# EAGLE design bc-led_pwm-universal (EAGLE 9.5.2)
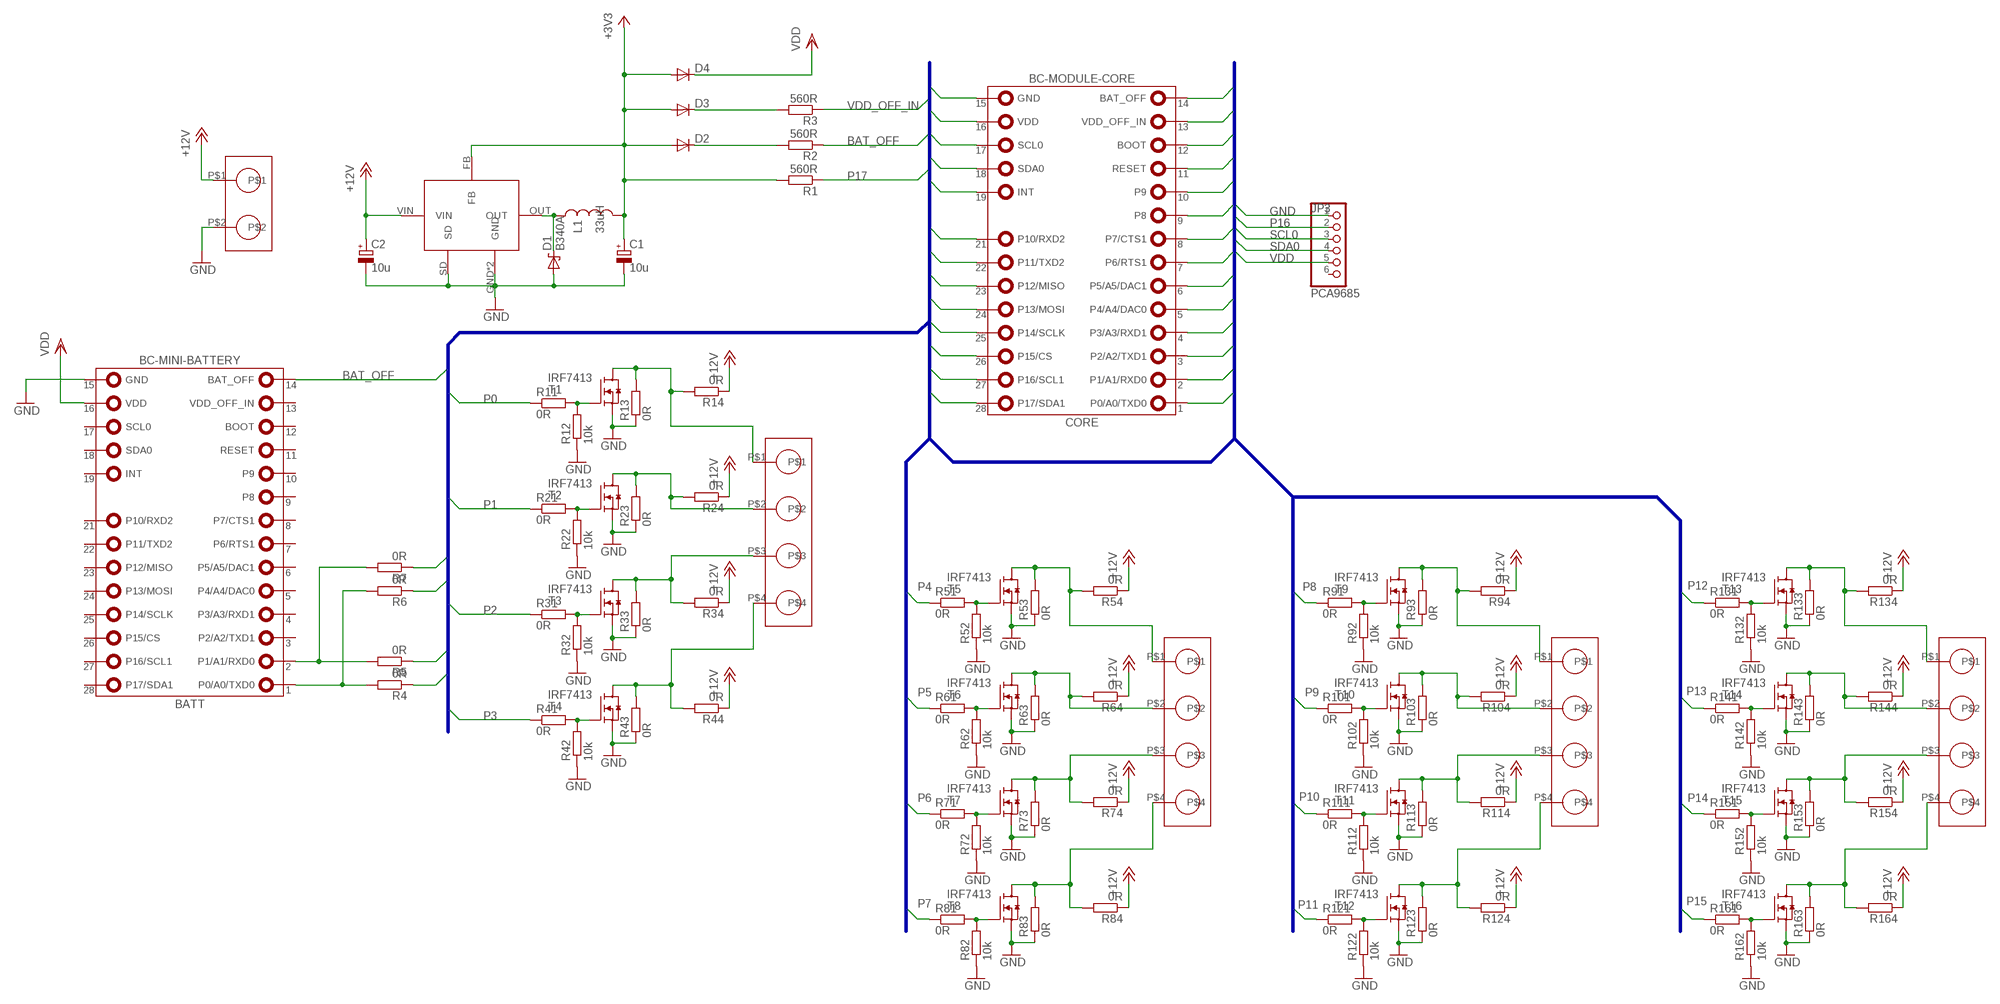
[diagram p0: schematic, sheet 1]

## Parts
BATT  BC-MINI-BATTERY  BC-MODULE-CORE  [BC-MODULE-CORE]
C1  10u  CPOL-EUE1.8-4  [E1,8-4]
C2  10u  CPOL-EUE2-5  [E2-5]
CORE  BC-MODULE-CORE  [BC-MODULE-CORE]
D1  B340A  SCHOTTKY-DIODESMD  [SMB]
D2  PMLL41SOD80C  [SOD80C]
D3  PMLL41SOD80C  [SOD80C]
D4  PMLL41SOD80C  [SOD80C]
JP1  STLZ950/2G-5.08-H  [HDR-5.08-1_2]
JP2A  STLZ950/4G-5.08-V  [HDR-5.08-1_4]
JP2B  STLZ950/4G-5.08-V  [HDR-5.08-1_4]
JP2C  STLZ950/4G-5.08-V  [HDR-5.08-1_4]
JP2D  STLZ950/4G-5.08-V  [HDR-5.08-1_4]
JP3  PCA9685  PINHD-1X6  [1X06]
L1  33uH  L-GENERIC-BC12  [BC12]
R1  560R  R-EU_R3216  [R3216]
R2  560R  R-EU_R3216  [R3216]
R3  560R  R-EU_R3216  [R3216]
R4  0R  R-EU_R3216  [R3216]
R5  0R  R-EU_R3216  [R3216]
R6  0R  R-EU_R3216  [R3216]
R7  0R  R-EU_R3216  [R3216]
R11  0R  R-EU_0207/7  [0207/7]
R12  10k  R-EU_R3216  [R3216]
R13  0R  R-EU_R3216  [R3216]
R14  0R  R-EU_R3216  [R3216]
R21  0R  R-EU_0207/7  [0207/7]
R22  10k  R-EU_R3216  [R3216]
R23  0R  R-EU_R3216  [R3216]
R24  0R  R-EU_R3216  [R3216]
R31  0R  R-EU_0207/7  [0207/7]
R32  10k  R-EU_R3216  [R3216]
R33  0R  R-EU_R3216  [R3216]
R34  0R  R-EU_R3216  [R3216]
R41  0R  R-EU_0207/7  [0207/7]
R42  10k  R-EU_R3216  [R3216]
R43  0R  R-EU_R3216  [R3216]
R44  0R  R-EU_R3216  [R3216]
R51  0R  R-EU_0207/7  [0207/7]
R52  10k  R-EU_R3216  [R3216]
R53  0R  R-EU_R3216  [R3216]
R54  0R  R-EU_R3216  [R3216]
R61  0R  R-EU_0207/7  [0207/7]
R62  10k  R-EU_R3216  [R3216]
R63  0R  R-EU_R3216  [R3216]
R64  0R  R-EU_R3216  [R3216]
R71  0R  R-EU_0207/7  [0207/7]
R72  10k  R-EU_R3216  [R3216]
R73  0R  R-EU_R3216  [R3216]
R74  0R  R-EU_R3216  [R3216]
R81  0R  R-EU_0207/7  [0207/7]
R82  10k  R-EU_R3216  [R3216]
R83  0R  R-EU_R3216  [R3216]
R84  0R  R-EU_R3216  [R3216]
R91  0R  R-EU_0207/7  [0207/7]
R92  10k  R-EU_R3216  [R3216]
R93  0R  R-EU_R3216  [R3216]
R94  0R  R-EU_R3216  [R3216]
R101  0R  R-EU_0207/7  [0207/7]
R102  10k  R-EU_R3216  [R3216]
R103  0R  R-EU_R3216  [R3216]
R104  0R  R-EU_R3216  [R3216]
R111  0R  R-EU_0207/7  [0207/7]
R112  10k  R-EU_R3216  [R3216]
R113  0R  R-EU_R3216  [R3216]
R114  0R  R-EU_R3216  [R3216]
R121  0R  R-EU_0207/7  [0207/7]
R122  10k  R-EU_R3216  [R3216]
R123  0R  R-EU_R3216  [R3216]
R124  0R  R-EU_R3216  [R3216]
R131  0R  R-EU_0207/7  [0207/7]
R132  10k  R-EU_R3216  [R3216]
R133  0R  R-EU_R3216  [R3216]
R134  0R  R-EU_R3216  [R3216]
R141  0R  R-EU_0207/7  [0207/7]
R142  10k  R-EU_R3216  [R3216]
R143  0R  R-EU_R3216  [R3216]
R144  0R  R-EU_R3216  [R3216]
R151  0R  R-EU_0207/7  [0207/7]
R152  10k  R-EU_R3216  [R3216]
R153  0R  R-EU_R3216  [R3216]
R154  0R  R-EU_R3216  [R3216]
R161  0R  R-EU_0207/7  [0207/7]
R162  10k  R-EU_R3216  [R3216]
R163  0R  R-EU_R3216  [R3216]
R164  0R  R-EU_R3216  [R3216]
T1  IRF7413  [SO8]
T2  IRF7413  [SO8]
T3  IRF7413  [SO8]
T4  IRF7413  [SO8]
T5  IRF7413  [SO8]
T6  IRF7413  [SO8]
T7  IRF7413  [SO8]
T8  IRF7413  [SO8]
T9  IRF7413  [SO8]
T10  IRF7413  [SO8]
T11  IRF7413  [SO8]
T12  IRF7413  [SO8]
T13  IRF7413  [SO8]
T14  IRF7413  [SO8]
T15  IRF7413  [SO8]
T16  IRF7413  [SO8]
U$1  AP1501  [TO263-5L]

## Nets
+3V3: C1.+ D2.A D3.A D4.A L1.2 R1.2 U$1.FB
+12V: C2.+ JP1.P$1 R14.1 R24.1 R34.1 R44.1 R54.1 R64.1 R74.1 R84.1 R94.1 R104.1 R114.1 R124.1 R134.1 R144.1 R154.1 R164.1 U$1.VIN
BAT_OFF: BATT.14(BAT_OFF) CORE.14(BAT_OFF) R2.1
BOOT: CORE.12(BOOT)
GND: BATT.15(GND) C1.- C2.- CORE.15(GND) D1.A JP1.P$2 JP3.1 R12.1 R13.1 R22.1 R23.1 R32.1 R33.1 R42.1 R43.1 R52.1 R53.1 R62.1 R63.1 R72.1 R73.1 R82.1 R83.1 R92.1 R93.1 R102.1 R103.1 R112.1 R113.1 R122.1 R123.1 R132.1 R133.1 R142.1 R143.1 R152.1 R153.1 R162.1 R163.1 T1.1(S) T1.2(S) T1.3(S) T2.1(S) T2.2(S) T2.3(S) T3.1(S) T3.2(S) T3.3(S) T4.1(S) T4.2(S) T4.3(S) T5.1(S) T5.2(S) T5.3(S) T6.1(S) T6.2(S) T6.3(S) T7.1(S) T7.2(S) T7.3(S) T8.1(S) T8.2(S) T8.3(S) T9.1(S) T9.2(S) T9.3(S) T10.1(S) T10.2(S) T10.3(S) T11.1(S) T11.2(S) T11.3(S) T12.1(S) T12.2(S) T12.3(S) T13.1(S) T13.2(S) T13.3(S) T14.1(S) T14.2(S) T14.3(S) T15.1(S) T15.2(S) T15.3(S) T16.1(S) T16.2(S) T16.3(S) U$1.GND U$1.GND2(GND) U$1.SD
INT: CORE.19(INT)
N$2: R11.2 R12.2 T1.4(G)
N$4: JP2A.P$1 R13.2 R14.2 T1.5(D) T1.6(D) T1.7(D) T1.8(D)
N$5: BATT.2(P1/A1/RXD0) R5.2 R7.2
N$6: BATT.1(P0/A0/TXD0) R4.2 R6.2
N$7: D1.C L1.1 U$1.OUT
N$8: R31.2 R32.2 T3.4(G)
N$9: JP2A.P$3 R33.2 R34.2 T3.5(D) T3.6(D) T3.7(D) T3.8(D)
N$10: R21.2 R22.2 T2.4(G)
N$11: JP2A.P$2 R23.2 R24.2 T2.5(D) T2.6(D) T2.7(D) T2.8(D)
N$12: R41.2 R42.2 T4.4(G)
N$13: JP2A.P$4 R43.2 R44.2 T4.5(D) T4.6(D) T4.7(D) T4.8(D)
N$14: D2.C R2.2
N$15: D3.C R3.2
N$22: R51.2 R52.2 T5.4(G)
N$23: JP2B.P$1 R53.2 R54.2 T5.5(D) T5.6(D) T5.7(D) T5.8(D)
N$24: R61.2 R62.2 T6.4(G)
N$25: JP2B.P$2 R63.2 R64.2 T6.5(D) T6.6(D) T6.7(D) T6.8(D)
N$26: R71.2 R72.2 T7.4(G)
N$27: JP2B.P$3 R73.2 R74.2 T7.5(D) T7.6(D) T7.7(D) T7.8(D)
N$28: R81.2 R82.2 T8.4(G)
N$29: JP2B.P$4 R83.2 R84.2 T8.5(D) T8.6(D) T8.7(D) T8.8(D)
N$38: R91.2 R92.2 T9.4(G)
N$39: JP2C.P$1 R93.2 R94.2 T9.5(D) T9.6(D) T9.7(D) T9.8(D)
N$40: R101.2 R102.2 T10.4(G)
N$41: JP2C.P$2 R103.2 R104.2 T10.5(D) T10.6(D) T10.7(D) T10.8(D)
N$42: R111.2 R112.2 T11.4(G)
N$43: JP2C.P$3 R113.2 R114.2 T11.5(D) T11.6(D) T11.7(D) T11.8(D)
N$44: R121.2 R122.2 T12.4(G)
N$45: JP2C.P$4 R123.2 R124.2 T12.5(D) T12.6(D) T12.7(D) T12.8(D)
N$54: R131.2 R132.2 T13.4(G)
N$55: JP2D.P$1 R133.2 R134.2 T13.5(D) T13.6(D) T13.7(D) T13.8(D)
N$56: R141.2 R142.2 T14.4(G)
N$57: JP2D.P$2 R143.2 R144.2 T14.5(D) T14.6(D) T14.7(D) T14.8(D)
N$58: R151.2 R152.2 T15.4(G)
N$59: JP2D.P$3 R153.2 R154.2 T15.5(D) T15.6(D) T15.7(D) T15.8(D)
N$60: R161.2 R162.2 T16.4(G)
N$61: JP2D.P$4 R163.2 R164.2 T16.5(D) T16.6(D) T16.7(D) T16.8(D)
P0: CORE.1(P0/A0/TXD0) R4.1 R11.1
P1: CORE.2(P1/A1/RXD0) R5.1 R21.1
P2: CORE.3(P2/A2/TXD1) R31.1
P3: CORE.4(P3/A3/RXD1) R41.1
P4: CORE.5(P4/A4/DAC0) R6.1 R51.1
P5: CORE.6(P5/A5/DAC1) R7.1 R61.1
P6: CORE.7(P6/RTS1) R71.1
P7: CORE.8(P7/CTS1) R81.1
P8: CORE.9(P8) R91.1
P9: CORE.10(P9) R101.1
P10: CORE.21(P10/RXD2) R111.1
P11: CORE.22(P11/TXD2) R121.1
P12: CORE.23(P12/MISO) R131.1
P13: CORE.24(P13/MOSI) R141.1
P14: CORE.25(P14/SCLK) R151.1
P15: CORE.26(P15/CS) R161.1
P16: CORE.27(P16/SCL1) JP3.2
P17: CORE.28(P17/SDA1) R1.1
RESET: CORE.11(RESET)
SCL0: CORE.17(SCL0) JP3.3
SDA0: CORE.18(SDA0) JP3.4
VDD: BATT.16(VDD) CORE.16(VDD) D4.C JP3.5
VDD_OFF_IN: CORE.13(VDD_OFF_IN) R3.1
Unconnected: BATT.3(P2/A2/TXD1) BATT.4(P3/A3/RXD1) BATT.5(P4/A4/DAC0) BATT.6(P5/A5/DAC1) BATT.7(P6/RTS1) BATT.8(P7/CTS1) BATT.9(P8) BATT.10(P9) BATT.11(RESET) BATT.12(BOOT) BATT.13(VDD_OFF_IN) BATT.17(SCL0) BATT.18(SDA0) BATT.19(INT) BATT.21(P10/RXD2) BATT.22(P11/TXD2) BATT.23(P12/MISO) BATT.24(P13/MOSI) BATT.25(P14/SCLK) BATT.26(P15/CS) BATT.27(P16/SCL1) BATT.28(P17/SDA1) JP3.6

## Buses
HARDWARIO:BAT_OFF,BOOT,GND,INT,P[0..17],RESET,SCL0,SDA0,VDD,VDD_OFF_IN

## Library data of the parts
BATT CORE = bigclown:BC-MODULE-CORE: BigClown Core Module Follow this link <https://shop.bigclown.com/products/core-module> for more information.
C1 C2 = resistor:CPOL-EU: POLARIZED CAPACITOR, European symbol
D1 = diode:SCHOTTKY-DIODE: Schottky Diode
D2-D4 = diode:PMLL41*: High-speed diodes Source: http://www.semiconductors.philips.com/acrobat_download/datasheets/PMLL4150_2.pdf
JP1 = mixi:STLZ950/2G-5.08-H
JP2A JP2B JP2C JP2D = mixi:STLZ950/4G-5.08-V
JP3 = pinhead:PINHD-1X6: PIN HEADER
L1 = mixi-inductors:L-GENERIC-BC12
R1-R7 R11-R14 R21-R24 R31-R34 R41-R44 R51-R54 R61-R64 R71-R74 R81-R84 R91-R94 R101-R104 R111-R114 R121-R124 R131-R134 R141-R144 R151-R154 R161-R164 = resistor:R-EU_: RESISTOR, European symbol
T1-T16 = mixi:IRF7413: IRF7413, N-channel HEXFET Vds = 30V, Id = 9.2A (58A pulsed)
U$1 = mixi:AP1501: AP1501 3A 150kHz PWM DC/DC converter

## Net classes
0 default: clearance 0.205 mm

## Board
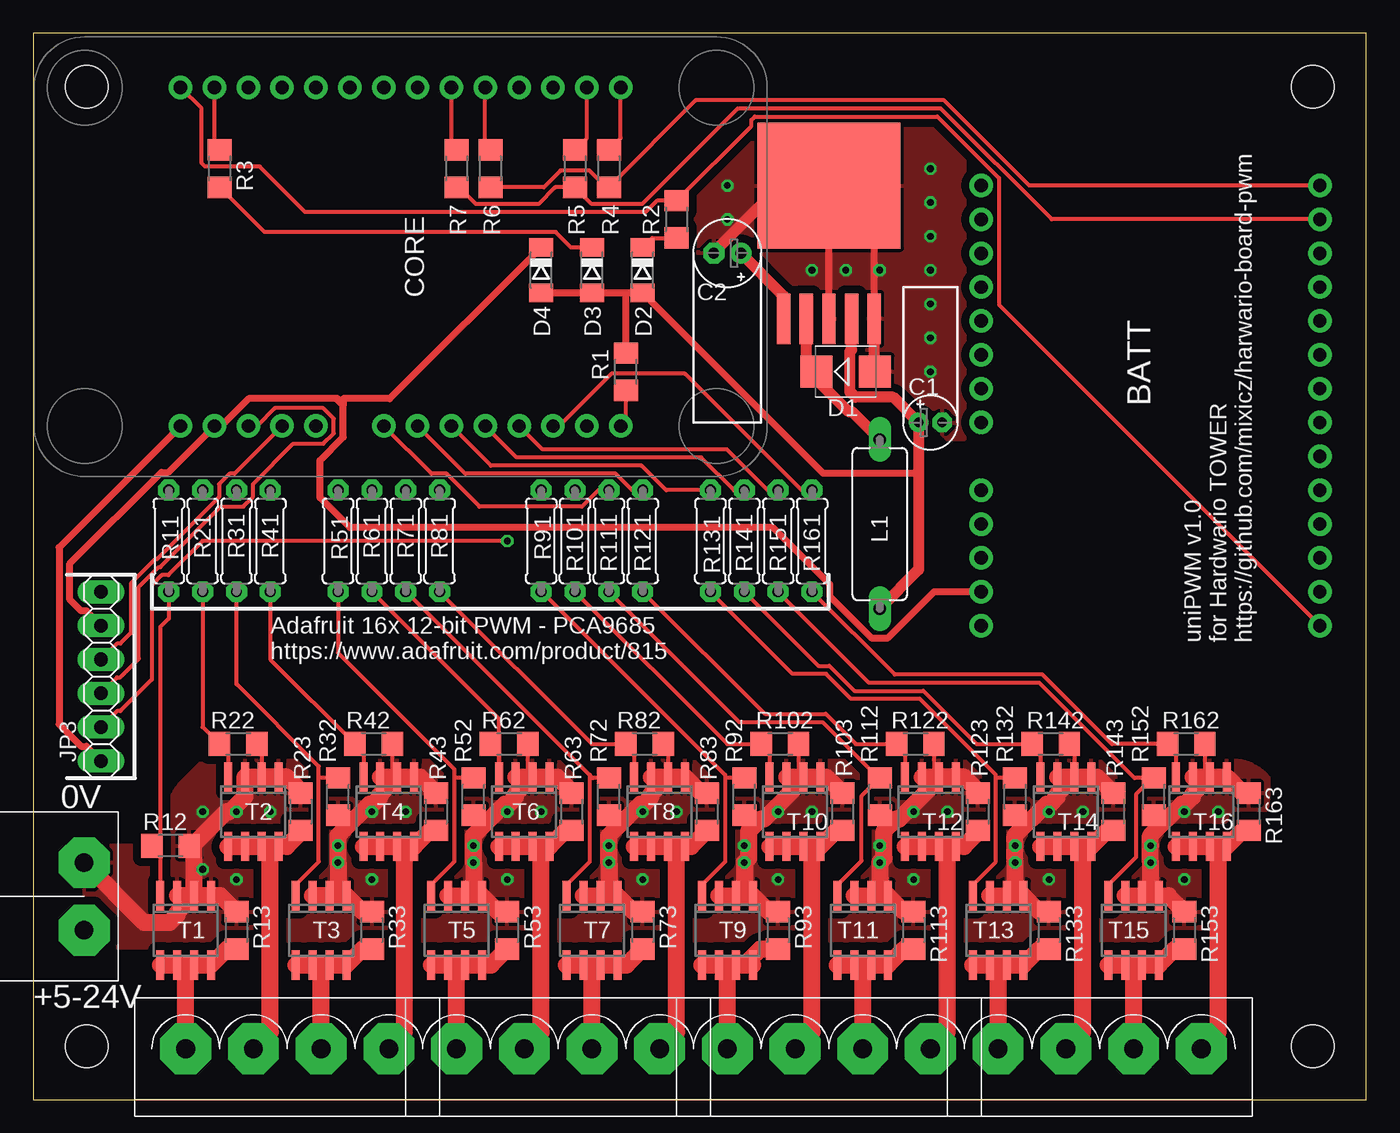
[diagram p1: board, top side]
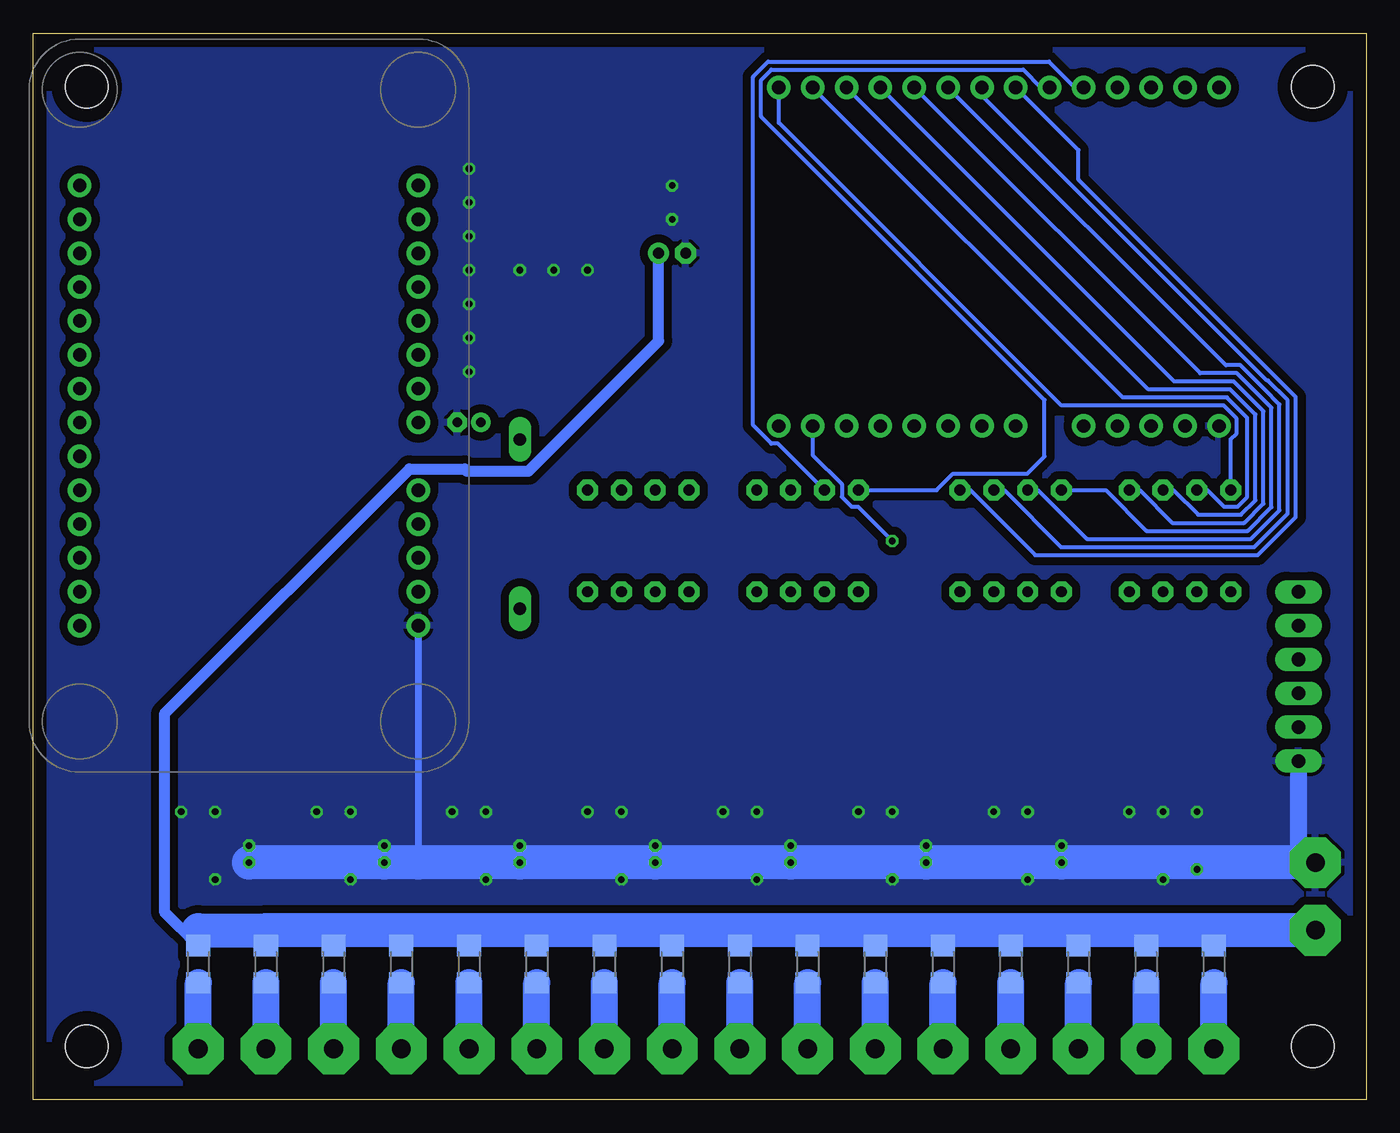
[diagram p2: board, bottom side, seen from below]

Size 100 x 80 mm. Coordinates in mm from the lower left corner, seen from the top.
Outline: 0,0 100,0 100,80 0,80 0,0
Copper layers (1*16): Top 0.035mm / dielectric 1.5mm / Bottom 0.035mm
Design rules "default *": minimum track width 0.3mm, minimum drill 0.35mm, track to track 0.3mm, track to pad 0.3mm, pad to pad 0.3mm, via to via 0.3mm, smd to smd 0.3mm, copper to edge 40mil, drill to drill 6mil, minimum pad ring 15mil, minimum via ring 8mil, stop-mask expansion 4mil, vias tented up to drill 0mil, thermal gap 10mil
Holes 3.2 mm at 4,4 96,4 96,76 4,76

### Footprints (pad centres in the part's own frame; a part is rotated, then mirrored left to right if it is on the bottom)
BC-MODULE-CORE = drill 1 pad 1.6: 1 -12.7,16.51; 2 -12.7,13.97; 3 -12.7,11.43; 4 -12.7,8.89; 5 -12.7,6.35; 6 -12.7,3.81; 7 -12.7,1.27; 8 -12.7,-1.27; 9 -12.7,-3.81; 10 -12.7,-6.35; 11 -12.7,-8.89; 12 -12.7,-11.43; 13 -12.7,-13.97; 14 -12.7,-16.51; 15 12.7,-16.51; 16 12.7,-13.97; 17 12.7,-11.43; 18 12.7,-8.89; 19 12.7,-6.35; 21 12.7,-1.27; 22 12.7,1.27; 23 12.7,3.81; 24 12.7,6.35; 25 12.7,8.89; 26 12.7,11.43; 27 12.7,13.97; 28 12.7,16.51
E1,8-4 = drill 0.711 pad 1.168: + -0.889,0 | drill 0.711 pad 1.168 octagon: - 0.889,0
E2-5 = drill 0.813 pad 1.27: + -1.016,0 | drill 0.813 pad 1.27 octagon: - 1.016,0
SMB = smd 2.4 x 2.4: A 2.2,0; C -2.2,0
SOD80C = smd 1.4 x 1.8: A 1.7,0; C -1.7,0
HDR-5.08-1_2 = drill 1.397 pad 3.81 octagon: P$1 0,2.54; P$2 0,-2.54
HDR-5.08-1_4 = drill 1.397 pad 3.81 octagon: P$1 0,7.62; P$2 0,2.54; P$3 0,-2.54; P$4 0,-7.62
1X06 = drill 1.016 long: 1 -6.35,0; 2 -3.81,0; 3 -1.27,0; 4 1.27,0; 5 3.81,0; 6 6.35,0
BC12 = drill 0.914 long: 1 -6.35,0; 2 6.35,0
R3216 = smd 1.6 x 1.8: 1 -1.4,0; 2 1.4,0
0207/7 = drill 0.813 octagon: 1 -3.81,0; 2 3.81,0
SO8 = smd 0.6 x 2.2: 1 -1.905,-2.6; 2 -0.635,-2.6; 3 0.635,-2.6; 4 1.905,-2.6; 5 1.905,2.6; 6 0.635,2.6; 7 -0.635,2.6; 8 -1.905,2.6
TO263-5L = smd 1 x 3.8: FB 1.7,-10; GND 0,-10; OUT -1.7,-10; SD 3.4,-10; VIN -3.4,-10 | smd 10.75 x 9.45: GND2 0,0

### Placement (x,y rotation side)
BATT  83.82,52.07 0 bottom
C1  67.31,50.8 0 top
C2  52.07,63.5 180 top
CORE  27.56,63.24 270 top
D1  60.96,54.61 0 top
D2  45.72,62.23 270 top
D3  41.91,62.23 270 top
D4  38.1,62.23 270 top
JP1  3.81,15.24 180 top
JP2A  19.05,3.81 90 top
JP2B  39.37,3.81 90 top
JP2C  59.69,3.81 90 top
JP2D  80.01,3.81 90 top
JP3  5.08,31.75 90 top
L1  63.5,43.18 270 top
R1  44.45,54.61 90 top
R2  48.26,66.04 270 top
R3  13.97,69.85 270 top
R4  43.18,69.85 270 top
R5  40.64,69.85 270 top
R6  34.29,69.85 270 top
R7  31.75,69.85 270 top
R11  10.16,41.91 270 top
R12  10.29,19.05 180 top
R13  15.24,12.7 270 top
R14  11.43,10.16 270 bottom
R21  12.7,41.91 270 top
R22  15.37,26.67 180 top
R23  20.07,21.59 270 top
R24  16.51,10.16 270 bottom
R31  15.24,41.91 270 top
R32  22.86,22.73 90 top
R33  25.4,12.7 270 top
R34  21.59,10.16 270 bottom
R41  17.78,41.91 270 top
R42  25.53,26.67 180 top
R43  30.23,21.59 270 top
R44  26.67,10.16 270 bottom
R51  22.86,41.91 270 top
R52  33.02,22.73 90 top
R53  35.56,12.7 270 top
R54  31.75,10.16 270 bottom
R61  25.4,41.91 270 top
R62  35.69,26.67 180 top
R63  40.39,21.59 270 top
R64  36.83,10.16 270 bottom
R71  27.94,41.91 270 top
R72  43.18,22.73 90 top
R73  45.72,12.7 270 top
R74  41.91,10.16 270 bottom
R81  30.48,41.91 270 top
R82  45.85,26.67 180 top
R83  50.55,21.59 270 top
R84  46.99,10.16 270 bottom
R91  38.1,41.91 270 top
R92  53.34,22.73 90 top
R93  55.88,12.7 270 top
R94  52.07,10.16 270 bottom
R101  40.64,41.91 270 top
R102  56.01,26.67 180 top
R103  60.71,21.59 270 top
R104  57.15,10.16 270 bottom
R111  43.18,41.91 270 top
R112  63.5,22.73 90 top
R113  66.04,12.7 270 top
R114  62.23,10.16 270 bottom
R121  45.72,41.91 270 top
R122  66.17,26.67 180 top
R123  70.87,21.59 270 top
R124  67.31,10.16 270 bottom
R131  50.8,41.91 270 top
R132  73.66,22.73 90 top
R133  76.2,12.7 270 top
R134  72.39,10.16 270 bottom
R141  53.34,41.91 270 top
R142  76.33,26.67 180 top
R143  81.03,21.59 270 top
R144  77.47,10.16 270 bottom
R151  55.88,41.91 270 top
R152  84.07,22.73 90 top
R153  86.36,12.7 270 top
R154  82.55,10.16 270 bottom
R161  58.42,41.91 270 top
R162  86.49,26.67 180 top
R163  91.19,21.59 270 top
R164  87.63,10.16 270 bottom
T1  11.43,12.7 180 top
T2  16.51,21.59 180 top
T3  21.59,12.7 180 top
T4  26.67,21.59 180 top
T5  31.75,12.7 180 top
T6  36.83,21.59 180 top
T7  41.91,12.7 180 top
T8  46.99,21.59 180 top
T9  52.07,12.7 180 top
T10  57.15,21.59 180 top
T11  62.23,12.7 180 top
T12  67.31,21.59 180 top
T13  72.39,12.7 180 top
T14  77.47,21.59 180 top
T15  82.55,12.7 180 top
T16  87.63,21.59 180 top
U$1  59.69,68.58 0 top

### Tracks (layer width: path | path; a pad name or v marks a point on that pad's centre or on a via)
+3V3
  Top 0.508: D4.A D3.A 44.45,60.53 | 44.45,60.53 D2.A 59.26,46.99 66.42,46.99 | R1.2 44.45,60.53
  Top 0.813: L1.2 66.42,39.75 66.42,46.99 C1.+ 64.52,52.7 61.67,52.7 61.25,53.12 61.25,56.1 61.39,56.24 U$1.FB
+12V
  Top 0.813: U$1.VIN 56.29,60.3 C2.+
  Bottom 0.813: R164.1 90.17,14.1 90.17,28.91 71.78,47.31 67.63,47.31 67.47,47.15 62.86,47.15 53.09,56.92 C2.+
  Bottom 1.27: R14.1 11.43,12.7 | R24.1 16.51,12.7 | R34.1 21.59,12.7 | R44.1 26.67,12.7 | R54.1 31.75,12.7 | R64.1 36.83,12.7 | R74.1 41.91,12.7 | R84.1 46.99,12.7 | R94.1 52.07,12.7 | R104.1 57.15,12.7 | R114.1 62.23,12.7 | R124.1 67.31,12.7 | R134.1 72.39,12.7 | R144.1 77.47,12.7 | R154.1 82.55,12.7 | R164.1 87.63,12.7
  Bottom 2.54: JP1.P$1 11.43,12.7 16.51,12.7 21.59,12.7 26.67,12.7 31.75,12.7 36.83,12.7 41.91,12.7 46.99,12.7 52.07,12.7 57.15,12.7 62.23,12.7 67.31,12.7 72.39,12.7 77.47,12.7 82.55,12.7 87.63,12.7
BAT_OFF
  Top 0.305: BATT.14 72.45,59.63 72.45,69.13 67.83,73.76 54.13,73.76 53.86,73.49 53.86,73.04 R2.1 46.78,67.44 45.93,66.59 20.39,66.59 16.99,70 12.88,70 12.62,70.26 12.62,74.37 CORE.14
GND  (via drill 0.5)
  Top 0.305: R162.1 87.89,24.57 T16.2 | R142.1 78.11,26.3 T14.2 | R152.1 84.07,20.06 83.82,19.81 | R132.1 73.66,19.81 | R122.1 67.57,24.57 T12.2 | R112.1 63.84,21 63.84,20.14 | R92.1 53.67,21 53.67,20.14 | R102.1 57.41,24.57 T10.2 | R82.1 47.62,26.3 T8.2 | R62.1 37.09,24.57 T6.2 | R42.1 26.93,24.57 T4.2 | R22.1 17.14,26.3 T2.2 | R12.1 11.81,19.17 12.06,19.17 | R32.1 v22.86,19.05 | R52.1 v33.02,19.05 | R72.1 v43.18,19.05
  Top 0.508: U$1.GND U$1.GND2 63.09,65.18 U$1.SD | JP3.1 3.98,26.5 3.59,26.5 1.94,28.15 1.94,41.43 CORE.15
  Top 0.813: D1.A 63.09,55.1 U$1.SD | C2.- 51.59,64.04 51.59,64.12 56.05,68.58 U$1.GND2
  Top 1.27: R13.1 14.04,15.3 T1.1 T1.2 | T1.2 T1.3 | R33.1 24.7,14.1 T3.1 T3.2 | T3.2 T3.3 | T4.3 T4.2 | R43.1 29.03,24.19 T4.1 T4.2 | T5.3 T5.2 | R53.1 34.85,14.1 T5.1 T5.2 | T7.3 T7.2 | R73.1 45.02,14.1 T7.1 T7.2 | T9.3 T9.2 | T9.2 T9.1 55.17,14.1 R93.1 | T11.3 T11.2 | T11.2 T11.1 65.33,14.1 R113.1 | T13.3 T13.2 | R133.1 75.5,14.1 T13.1 T13.2 | T15.3 T15.2 | R153.1 85.16,15.3 T15.1 T15.2 | T16.3 T16.2 | R163.1 90.73,22.99 T16.1 T16.2 | T14.3 T14.2 | R143.1 79.83,24.19 T14.1 T14.2 | T10.3 T10.2 | T10.2 T10.1 59.51,24.19 R103.1 | T8.3 T8.2 | T8.2 T8.1 50.09,22.99 R83.1 | T6.3 T6.2 | R63.1 40.51,22.99 39.31,24.19 T6.1 T6.2 | T5.2 33.02,15.94 v33.02,17.78 v33.02,19.05 33.02,19.81 35.37,22.16 35.61,22.16 36.16,22.7 36.16,22.89 T6.2 | T7.2 43.18,15.94 v43.18,17.78 v43.18,19.05 43.18,19.81 45.53,22.16 45.77,22.16 46.32,22.7 46.32,22.89 T8.2 | T9.2 53.34,15.94 v53.34,17.78 53.67,18.11 53.67,20.14 54.56,21.02 54.8,21.02 57.78,24.01 T10.2 | T11.2 63.5,15.94 v63.5,17.78 63.84,18.11 63.84,20.14 64.72,21.02 64.96,21.02 67.94,24.01 T12.2 | T13.2 73.66,15.94 v73.66,17.78 v73.66,19.05 73.66,19.81 76.01,22.16 76.25,22.16 76.8,22.7 76.8,22.89 T14.2 | T15.2 83.82,15.94 v83.82,17.78 v83.82,19.05 83.82,19.81 86.17,22.16 86.41,22.16 86.96,22.7 86.96,22.89 T16.2 | T1.2 12.06,19.17 14.48,21.59 14.73,21.59 15.88,22.74 T2.3 T2.2 T2.1 19.02,24.19 20.07,23.14 R23.1 | R123.1 70.87,23.14 69.82,24.19 T12.1 T12.2 | T12.3 T12.2 | T3.2 22.86,15.94 v22.86,17.78 v22.86,19.05 22.86,19.81 25.21,22.16 25.45,22.16 26,22.7 26,22.89 T4.2 | T1.2 10.76,13.99 10.76,13.81 10.21,13.27 8.32,13.27 JP1.P$2
  Bottom 0.508: BATT.15 71.12,17.78
  Bottom 1.27: JP3.1 5.08,17.78
  Bottom 2.54: JP1.P$2 5.08,17.78 v22.86,17.78 v33.02,17.78 v43.18,17.78 v53.34,17.78 v63.5,17.78 71.12,17.78 v73.66,17.78 v83.82,17.78
  other vias: 66.04,16.51 55.88,16.51 53.34,19.05 45.72,16.51 35.56,16.51 25.4,16.51 86.36,16.51 76.2,16.51 63.5,19.05 25.4,21.59 27.94,21.59 35.56,21.59 38.1,21.59 45.72,21.59 48.26,21.59 55.88,21.59 58.42,21.59 66.04,21.59 68.58,21.59 76.2,21.59 78.74,21.59 86.36,21.59 88.9,21.59 58.42,62.23 60.96,62.23 63.5,62.23 67.31,54.61 67.31,57.15 67.31,59.69 67.31,62.23 67.31,64.77 67.31,67.31 67.31,69.85 52.07,66.04 52.07,68.58 15.24,16.51 17.78,21.59 15.24,21.59 12.7,21.59 12.7,17.27
  pour Bottom (isolate 0.61): 0,80.01 100.33,80.01 100.33,0 0,0
  pour Top (isolate 0.61): 12.7,25.4 11.1,23.8 arc45 10.16,21.53 10.16,19.05 3.81,19.05 3.81,11.43 88.9,11.43 88.9,16.45 arc-45 89.84,18.72 91.44,20.32 91.77,20.65 arc45 92.71,22.92 92.71,24.13 92.38,24.46 arc45 90.11,25.4
  pour Top (isolate 0.61): 49.53,63.5 49.53,73.66 68.58,73.66 68.91,73.33 arc-45 69.85,71.06 69.85,49.53 68.58,49.53 55.55,62.56 arc45 53.28,63.5
N$2
  Top 0.305: R11.2 10.16,36.09 9.53,35.46 9.53,19.05 | 9.53,19.05 T1.4 | R12.2 9.53,19.05
N$4
  Top 1.27: T1.5 T1.6 T1.7 | T1.7 T1.8 14.54,11.3 R13.2 | JP2A.P$1 11.43,9.46 T1.7
  Bottom 2.032: JP2A.P$1 R14.2
N$5
  Top 0.305: R7.2 31.95,68.45 33.2,67.2 37.9,67.2 39.16,68.45 R5.2 41.89,67.2 45.68,67.2 52.84,74.36 68.08,74.36 76.4,66.04 BATT.2
N$6
  Top 0.305: R6.2 38.3,68.45 39.55,69.7 41.73,69.7 42.98,68.45 R4.2 49.7,74.97 68.33,74.97 74.72,68.58 BATT.1
N$7
  Top 0.813: U$1.OUT 57.99,54.95 D1.C 58.76,54.04 61.21,51.59 61.44,51.59 L1.1
N$8
  Top 0.305: T3.4 19.68,16.1 21.42,17.83 21.42,24.13 | 21.42,24.13 21.42,24.99 15.24,31.17 R31.2 | R32.2 21.42,24.13
N$9
  Top 1.27: T3.5 T3.6 T3.7 | T3.7 T3.8 24.7,11.3 R33.2 | JP2A.P$3 21.59,9.46 T3.7
  Bottom 2.032: JP2A.P$3 R34.2
N$10
  Top 0.305: T2.4 14.61,26.04 R22.2 12.7,27.94 R21.2
N$11
  Top 1.27: R23.2 20.07,20.04 19.02,18.99 T2.8 17.78,18.99 | 17.78,18.99 T2.7 T2.6 T2.5 | JP2A.P$2 17.78,5.08 17.78,18.99
  Bottom 2.032: JP2A.P$2 R24.2
N$12
  Top 0.305: T4.4 24.77,26.04 R42.2 17.78,33.02 R41.2
N$13
  Top 1.27: T4.5 T4.6 T4.7 | T4.7 T4.8 29.77,20.19 R43.2 | T4.7 27.81,18.48 27.81,4.95 JP2A.P$4
  Bottom 2.032: JP2A.P$4 R44.2
N$14
  Top 0.305: D2.C 46.43,64.64 R2.2
N$15
  Top 0.305: D3.C 40.34,63.93 39.19,65.08 17.34,65.08 R3.2
N$22
  Top 0.305: R51.2 22.86,33.52 31.58,24.8 31.58,24.13 | 31.58,24.13 31.58,17.83 29.84,16.1 T5.4 | R52.2 31.58,24.13
N$23
  Top 1.27: T5.5 T5.6 T5.7 | T5.7 T5.8 34.36,10.1 R53.2 | JP2B.P$1 31.75,9.46 T5.7
  Bottom 2.032: JP2B.P$1 R54.2
N$24
  Top 0.305: R62.2 34.92,26.04 T6.4 34.92,28.57 R61.2
N$25
  Top 1.27: T6.5 T6.6 T6.7 38.1,18.99 | 38.1,18.99 T6.8 39.94,20.19 R63.2 | JP2B.P$2 38.1,5.08 38.1,18.99
  Bottom 2.032: JP2B.P$2 R64.2
N$26
  Top 0.305: R71.2 28,38.1 41.74,24.36 | 41.74,24.36 41.74,17.83 40.01,16.1 T7.4 | R72.2 41.97,24.13 41.74,24.36
N$27
  Top 1.27: T7.5 T7.6 T7.7 | T7.7 T7.8 44.52,10.1 R73.2 | JP2B.P$3 41.91,9.46 T7.7
  Bottom 2.032: JP2B.P$3 R74.2
N$28
  Top 0.305: T8.4 45.09,26.04 R82.2 41.91,26.67 R81.2
N$29
  Top 1.27: T8.5 T8.6 T8.7 | 48.26,18.99 49.35,18.99 R83.2 | JP2B.P$4 48.26,5.08 48.26,18.99 | T8.7 48.26,18.99 | T8.8 T8.7
  Bottom 2.032: JP2B.P$4 R84.2
N$38
  Top 0.305: R91.2 38.16,38.1 51.9,24.36 51.9,24.13 | 51.9,24.13 51.9,17.83 50.16,16.1 T9.4 | R92.2 51.9,24.13
N$39
  Top 1.27: T9.5 T9.6 T9.7 | T9.7 53.34,10.1 | 53.34,10.1 T9.8 | 53.34,10.1 54.54,11.3 R93.2 | JP2C.P$1 52.07,9.46 T9.7
  Bottom 2.032: JP2C.P$1 R94.2
N$40
  Top 0.305: T10.4 55.24,26.04 R102.2 52.07,26.67 R101.2
N$41
  Top 1.27: T10.5 T10.6 T10.7 58.42,18.99 | 58.42,18.99 T10.8 60.26,20.19 R103.2 | JP2C.P$2 58.42,5.08 58.42,18.99
  Bottom 2.032: JP2C.P$2 R104.2
N$42
  Top 0.305: R111.2 52.95,28.33 59.2,28.33 63.4,24.13 R112.2 62.15,22.78 62.15,17.92 60.33,16.1 T11.4
N$43
  Top 1.27: T11.5 T11.6 T11.7 | T11.7 T11.8 65.33,11.3 R113.2 | JP2C.P$3 62.23,9.46 T11.7
  Bottom 2.032: JP2C.P$3 R114.2
N$44
  Top 0.305: T12.4 65.41,26.04 R122.2 61.72,26.67 59.45,28.93 54.89,28.93 R121.2
N$45
  Top 1.27: R123.2 70.87,20.04 69.82,18.99 T12.8 T12.7 | T12.5 T12.6 T12.7 | JP2C.P$4 68.58,5.08 68.58,19.05 68,19.05 T12.7
  Bottom 2.032: JP2C.P$4 R124.2
N$54
  Top 0.305: T13.4 70.48,16.1 72.22,17.83 72.22,24.13 | 72.22,24.13 72.22,24.36 66.52,30.06 61.35,30.06 59.48,31.94 56.96,31.94 R131.2 | R132.2 72.22,24.13
N$55
  Top 1.27: T13.5 T13.6 T13.7 | T13.7 T13.8 75.5,11.3 R133.2 | JP2D.P$1 72.39,9.46 T13.7
  Bottom 2.032: JP2D.P$1 R134.2
N$56
  Top 0.305: R141.2 58.9,32.55 59.73,32.55 61.6,30.67 66.77,30.67 70.77,26.67 R142.2 75.56,26.04 T14.4
N$57
  Top 1.27: T14.5 T14.6 T14.7 78.74,18.99 | 78.74,18.99 T14.8 80.58,20.19 R143.2 | JP2D.P$2 78.74,5.08 78.74,18.99
  Bottom 2.032: JP2D.P$2 R144.2
N$58
  Top 0.305: T15.4 80.64,16.1 82.72,18.18 82.72,22.88 83.97,24.13 R152.2 82.61,24.13 75.47,31.27 62.71,31.27 R151.2
N$59
  Top 1.27: T15.5 T15.6 T15.7 | T15.7 T15.8 85.66,11.3 R153.2 | JP2D.P$3 82.55,9.46 T15.7
  Bottom 2.032: JP2D.P$3 R154.2
N$60
  Top 0.305: T16.4 85.72,26.04 R162.2 80.92,26.67 75.72,31.88 64.64,31.88 R161.2
N$61
  Top 1.27: T16.5 T16.6 T16.7 88.9,18.99 | 88.9,18.99 T16.8 90.73,20.19 R163.2 | JP2D.P$4 88.9,5.08 88.9,18.99
  Bottom 2.032: JP2D.P$4 R164.2
P0
  Top 0.305: R4.1 44.07,72.14 CORE.1
  Bottom 0.305: R11.1 10.16,49.54 9.71,49.98 9.71,51.09 10.7,52.07 22.86,52.07 44.07,73.28 CORE.1
P1
  Top 0.305: R5.1 41.53,72.14 CORE.2
  Bottom 0.305: CORE.2 18.27,52.67 10.45,52.67 8.92,51.15 8.92,45.21 9.65,44.48 10.67,44.48 11.91,45.72 R21.1
P2
  Bottom 0.305: CORE.3 16.33,53.28 10.2,53.28 8.31,51.4 8.31,44.96 9.4,43.88 12.61,43.88 14.45,45.72 R31.1
P3
  Bottom 0.305: CORE.4 14.4,53.88 9.95,53.88 7.71,51.65 7.71,44.7 9.14,43.27 14.54,43.27 16.99,45.72 R41.1
P4
  Top 0.305: R6.1 33.91,71.63 CORE.5
  Bottom 0.305: CORE.5 12.46,54.49 9.69,54.49 7.11,51.9 7.11,44.45 8.89,42.67 16.48,42.67 19.53,45.72 R51.1
P5
  Top 0.305: R7.1 31.37,71.63 CORE.6
  Bottom 0.305: R61.1 24.61,45.72 20.95,42.06 8.64,42.06 6.5,44.2 6.5,52.15 7.62,53.27 9.44,55.09 10.53,55.09 CORE.6
P6
  Bottom 0.305: R71.1 27.15,45.72 22.89,41.46 8.39,41.46 5.9,43.95 5.9,52.47 7.37,53.95 7.44,53.95 28.83,75.33 CORE.7
P7
  Bottom 0.305: R81.1 29.69,45.72 24.82,40.85 8.14,40.85 5.29,43.7 5.29,52.72 21.59,69.02 21.59,71.24 CORE.8
P8
  Bottom 0.305: R91.1 32.23,45.72 30.99,46.96 25.43,46.96 24.13,48.26 24.13,52.48 45.4,73.76 45.4,76.49 44.62,77.27 25.74,77.27 24.4,75.94 CORE.9
P9
  Bottom 0.305: R101.1 44.12,49.2 44.62,49.2 46.01,50.59 46.01,76.74 44.87,77.87 23.8,77.87 21.86,75.94 CORE.10
P10
  Top 0.305: R111.1 42.39,45.72 41.15,44.48 33.47,44.48 30.99,46.96 29.86,46.96 CORE.21
P11
  Top 0.305: R121.1 44.93,45.72 43.69,46.96 32.4,46.96 CORE.22
P12
  Top 0.305: CORE.23 34.34,47.56 45.63,47.56 47.47,45.72 R131.1
P13
  Top 0.305: CORE.24 36.27,48.17 50.1,48.17 52.55,45.72 R141.1
P14
  Top 0.305: CORE.25 38.21,48.77 52.04,48.77 55.09,45.72 R151.1
P15
  Top 0.305: R161.1 57.63,45.72 48.89,54.46 43.36,54.46 39.44,50.54 CORE.26
P16  (via drill 0.5)
  Top 0.305: v35.56,41.91 12.7,41.91 10.13,39.34 9.65,39.34 8.89,38.58 8.89,31.5 6.53,29.14 6.28,29.14 JP3.2
  Bottom 0.305: v35.56,41.91 38.13,44.48 38.61,44.48 39.34,45.21 39.34,46.17 41.53,48.36 CORE.27
P17
  Top 0.305: CORE.28 44.45,50.92 R1.1
SCL0
  Top 0.305: JP3.3 6.28,31.68 6.53,31.68 7.92,33.07 7.92,38.46 9.4,39.95 9.53,39.95 14.07,44.48 15.75,44.48 16.48,45.21 16.48,46.17 19.51,49.2 21.76,49.2 22.54,49.98 22.54,51.09 21.76,51.87 18.12,51.87 16.78,50.54 CORE.17
SDA0
  Top 0.305: CORE.18 15.09,46.96 14.73,46.96 13.94,46.17 13.94,45.21 9.28,40.55 9.14,40.55 7.31,38.71 7.31,35 6.53,34.22 6.28,34.22 JP3.4
VDD
  Top 0.508: JP3.5 3.98,36.66 3.59,36.66 2.75,37.5 2.75,40.2 9.6,47.06 10.11,47.06 CORE.16 14.1,50.54 16.14,52.58 22.86,52.58 22.86,52.46 23.25,52.07 | 23.25,52.07 23.25,49.69 21.52,47.96 21.52,45.16 23.77,42.92 55.5,42.92 59.76,38.66 59.76,37.76 62.92,34.6 64.08,34.6 67.58,38.1 BATT.16 | 23.25,52.07 23.25,52.58 26.75,52.58 D4.C
VDD_OFF_IN
  Top 0.305: R3.1 13.59,71.63 CORE.13

### Text on the board
tPlace: BATT | uniPWM v1.0 / for Hardwario TOWER / https://github.com/mixicz/harwario-board-pwm | Adafruit 16x 12-bit PWM - PCA9685 / https://www.adafruit.com/product/815 | 0V | +5-24V